# Altium schematic sheet BUCKCONVERTER - POWER.SchDoc
size A4; SheetNumber: 4; SheetTotal: 5
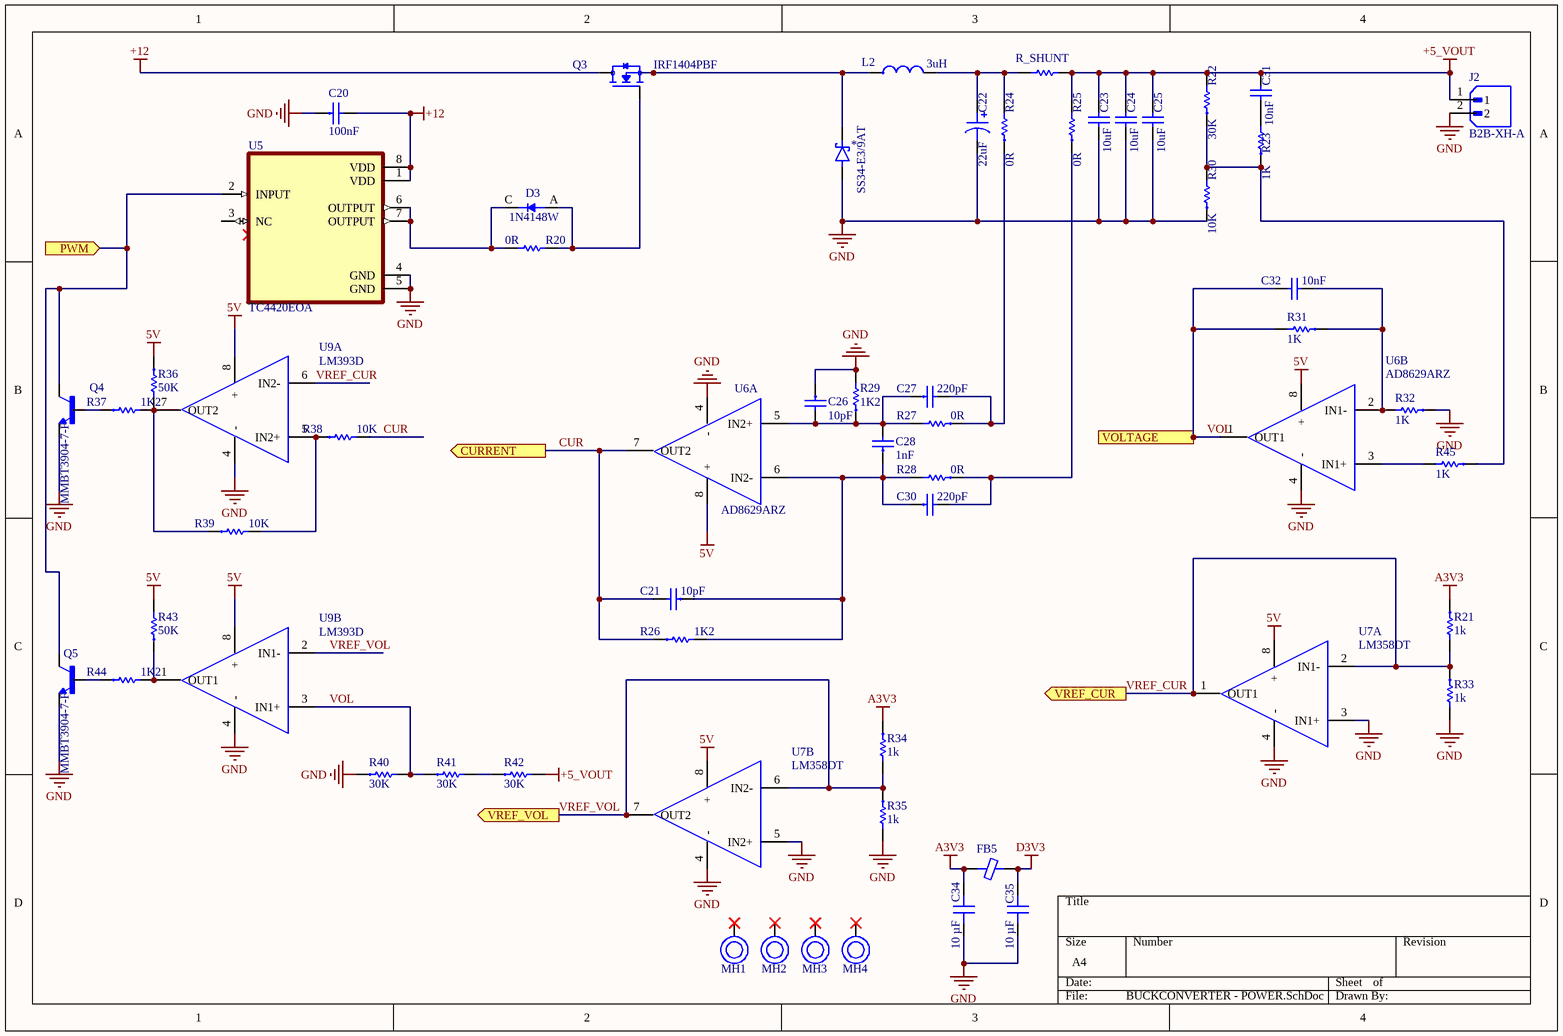
[diagram p0: BUCKCONVERTER - POWER.SchDoc]

## Parts
*  SS34-E3/9AT  [SS34]
C20  100nF  [CAP-CER0402-20mil]
C21  10pF  [CAP-CER0603-0.8H]
C22  22uF  [330UF-5mm]
C23  10uF  [Cap cer 0603]
C24  10uF  [Cap cer 0603]
C25  10uF  [Cap cer 0603]
C26  10pF  [CAP-CER0603-0.8H]
C27  220pF  [CAP-CER0603-0.8H]
C28  1nF  [CAP-CER0603-0.8H]
C30  220pF  [CAP-CER0603-0.8H]
C31  10nF  [Cap cer 0603]
C32  10nF  [Cap cer 0603]
C34  10 µF  [CAP 0603]
C35  10 µF  [CAP 0603]
D3  1N4148W  [1N4148]
FB5  330 Ohms @ 100 MHz  [FB_0603]  (value not drawn)
J2  B2B-XH-A  [JST_B2B-XH-A]
L2  3uH  [IND-06030-1uH]
MH1  MOUNTING HOLE  [M3]  (value not drawn)
MH2  MOUNTING HOLE  [M3]  (value not drawn)
MH3  MOUNTING HOLE  [M3]  (value not drawn)
MH4  MOUNTING HOLE  [M3]  (value not drawn)
Q3  IRF1404PBF  [TO220 AB]
Q4  MMBT3904-7-F  [MMBT3904]
Q5  MMBT3904-7-F  [MMBT3904]
R20  0R  [Res 0603]
R21  1k  [RES-CHP0402-0.35H]
R22  30K  [RES-CHP0603-0.45H-272]
R23  1K  [RES-CHP0603-0.45H-272]
R24  0R  [RES-CHP0603-0.45H-272]
R25  0R  [RES-CHP0603-0.45H-272]
R26  1K2  [RES-CHP0603-0.45H-272]
R27  0R  [RES-CHP0603-0.45H-272]
R28  0R  [RES-CHP0603-0.45H-272]
R29  1K2  [RES-CHP0603-0.45H-272]
R30  10K  [RES-CHP0603-0.45H-272]
R31  1K  [RES-CHP0603-0.45H-272]
R32  1K  [RES-CHP0603-0.45H-272]
R33  1k  [RES-CHP0402-0.35H]
R34  1k  [RES-CHP0402-0.35H]
R35  1k  [RES-CHP0402-0.35H]
R36  50K  [RES-CHP0603-0.45H-272]
R37  1K2  [RES-CHP0603-0.45H-272]
R38  10K  [RES-CHP0603-0.45H-272]
R39  10K  [RES-CHP0603-0.45H-272]
R40  30K  [RES-CHP0402-0.35H]
R41  30K  [RES-CHP0402-0.35H]
R42  30K  [RES-CHP0402-0.35H]
R43  50K  [RES-CHP0603-0.45H-272]
R44  1K2  [RES-CHP0603-0.45H-272]
R45  1K  [RES-CHP0603-0.45H-272]
R_SHUNT  0.01R  [R_SHUNT]  (value not drawn)
U5  TC4420EOA  [SOIC127P600X175-8N]
U6  AD8629ARZ  [AD8629ARZ]  (parts A,B of 2)
U7  LM358DT  [SOIC 8]  (parts A,B of 2)
U9  LM393D  [LM393]  (parts A,B of 2)

## Ports
CURRENT (out), PWM (in), VOLTAGE (out), VREF_CUR (out), VREF_VOL (out)

## Nets
5V: R36.1 R43.2 U6.8(+) U7.8(+) U9.8(+)
+5_VOUT: C23.2 C24.2 C25.2 C31.2 J2.1 R22.2 R25.2 R42.2 R_SHUNT.2
+12: C20.2 Q3.2(D) U5.1(VDD) U5.8(VDD)
A3V3: C34.2 FB5.1 R21.1 R34.1
D3V3: C35.2 FB5.2
GND: *.A C20.1 C22.2 C23.1 C24.1 C25.1 C26.1 C34.1 C35.1 J2.2 Q4.E Q5.E R29.2 R30.1 R32.1 R33.2 R35.2 R40.1 U5.4(GND) U5.5(GND) U6.4(-) U7.3(IN1+) U7.4(-) U7.5(IN2+) U9.4(-)
CUR: C21.2 R26.1 R38.2 U6.7(OUT2) ; port CURRENT
PWM: Q4.C Q5.C U5.2(INPUT) ; port PWM
VOL: C32.2 R31.2 R40.2 R41.1 U6.1(OUT1) U9.3(IN1+) ; port VOLTAGE
VREF_CUR: R21.2 R33.1 U7.1(OUT1) U7.2(IN1-) U9.6(IN2-) ; port VREF_CUR
VREF_VOL: R34.2 R35.1 U7.6(IN2-) U7.7(OUT2) U9.2(IN1-) ; port VREF_VOL
Net*_C: *.C(K) L2.1 Q3.3(S)
NetC21_1: C21.1 C28.1 C30.1 R26.2 R28.2 U6.6(IN2-)
NetC22_1: C22.1 L2.2 R24.2 R_SHUNT.1
NetC26_2: C26.2 C27.1 C28.2 R27.2 R29.1 U6.5(IN2+)
NetC27_2: C27.2 R24.1 R27.1
NetC30_2: C30.2 R25.1 R28.1
NetC31_1: C31.1 R23.2
NetC32_1: C32.1 R31.1 R32.2 U6.2(IN1-)
NetD3_A: D3.A Q3.1(G) R20.2
NetD3_C: D3.C(K) R20.1 U5.6(OUTPUT) U5.7(OUTPUT)
NetQ4_B: Q4.B R37.1
NetQ5_B: Q5.B R44.1
NetR22_1: R22.1 R23.1 R30.2 R45.1
NetR36_2: R36.2 R37.2 R39.1 U9.7(OUT2)
NetR38_1: R38.1 R39.2 U9.5(IN2+)
NetR41_2: R41.2 R42.1
NetR43_1: R43.1 R44.2 U9.1(OUT1)
NetR45_2: R45.2 U6.3(IN1+)

Not connected (* = marked no-connect by the designer): MH1 1(GND)*; MH2 1(GND)*; MH3 1(GND)*; MH4 1(GND)*; U5 3(NC)

## Library data of the parts
* = SS34-E3/9AT: Rectifier Diode, Schottky, 1 Phase, 1 Element, 3A, 40V V(RRM), Silicon, DO-214AB; Manufacturer: Vishay; Element Configuration: Single; Forward Voltage: 500mV; Max Forward Surge Current (Ifsm): 100A; Max Junction Temperature (Tj): 150°C; Max Reverse Leakage Current: 500µA; Number of Elements: 1; Supplier 1: Avnet; Manufacturer Part Number: SS34-E3/9AT; RoHS: Compliant; Category: Rectifier Diodes; Stock 1: 31500; Pricing 1: 3500=0,08437 (USD); Average Rectified Current: 3A; Case/Package: SMC; China RoHS: Non-Compliant; Forward Current: 3A; Height: 2.62mm; Lifecycle Status: Production; Max Operating Temperature: 150°C; Max Output Current: 3A; Max Repetitive Reverse Voltage (Vrrm): 40V; Max Reverse Voltage (DC): 40V; Max Surge Current: 100A; Min Operating Temperature: -55°C; Mount: Surface Mount; Number of Pins: 2; Number of Terminals: 2; Peak Non-Repetitive Surge Current: 100A; Peak Reverse Current: 500µA; Radiation Hardening: No; REACH SVHC: No; Reverse Standoff Voltage: 40V; Reverse Voltage: 40V; Schedule B: 8541100080, 8541100080|8541100080|8541100080|8541100080|8541100080; ComponentLink1URL: https://datasheet.octopart.com:443/SS34-E3-9AT-Vishay-datasheet-181475108.pdf?src-supplier=IHS; ComponentLink1Description: https://datasheet.octopart.com:443/SS34-E3-9AT-Vishay-datasheet-181475108.pdf?src-supplier=IHS; ComponentLink2URL: https://datasheet.octopart.com:443/SS34-E3-9AT-Vishay-datasheet-138899081.pdf?src-supplier=Upverter; ComponentLink2Description: https://datasheet.octopart.com:443/SS34-E3-9AT-Vishay-datasheet-138899081.pdf?src-supplier=Upverter; ComponentLink3URL: https://datasheet.octopart.com:443/SS34-E3-9AT-Vishay-datasheet-188933186.pdf?src-supplier=TME; ComponentLink3Description: https://datasheet.octopart.com:443/SS34-E3-9AT-Vishay-datasheet-188933186.pdf?src-supplier=TME; ComponentLink4URL: https://datasheet.octopart.com:443/SS34-E3-9AT-Vishay-datasheet-15599040.pdf?src-supplier=Future+Electronics; ComponentLink4Description: https://datasheet.octopart.com:443/SS34-E3-9AT-Vishay-datasheet-15599040.pdf?src-supplier=Future+Electronics; ComponentLink5URL: https://datasheet.octopart.com:443/SS34-E3/9AT-Vishay-datasheet-11610764.pdf?src-supplier=Arrow+Electronics; ComponentLink5Description: https://datasheet.octopart.com:443/SS34-E3/9AT-Vishay-datasheet-11610764.pdf?src-supplier=Arrow+Electronics; ComponentLink6URL: http://sigma.octopart.com:80/rohs_statement/Vishay-company-15.pdf?src-supplier=Compliance+Statements; ComponentLink6Description: http://sigma.octopart.com:80/rohs_statement/Vishay-company-15.pdf?src-supplier=Compliance+Statements; Supplier Part Number 1: SS34-E3/9AT
C20 = CAPCER0040 10uF 20% 6.3V X5R 0402 SMD: CAP CER 10uF 20% 6.3V X5R 0402 SMD; LINE: SMT; TYPE: EP; UNIT: PCS; TMG PN: CAPCER0013; TMG CODE: None; CERTIFICATION: NA; CLASS: B; MOUNT: SMD; ComponentLink1Description: Datasheet; ComponentLink1URL: https://datasheet.lcsc.com/lcsc/2304140030_YAGEO-CC0402MRX5R5BB106_C105884.pdf; Footprint: 0402
C21 C26-C28 C30 = CAPCER0003 220pF 10% 50V X7R 0603 SMD: CAP CER 220pF 10% 50V X7R 0603 SMD; LINE: SMT; TYPE: EP; UNIT: PCS; TMG CODE: None; CERTIFICATION: NA; CLASS: B; MOUNT: SMD; TMG PN: CAPCER0003; ComponentLink1Description: Datasheet; ComponentLink1URL: https://datasheet.lcsc.com/lcsc/1810261515_Samsung-Electro-Mechanics-CL10B221KB8NNNC_C1603.pdf; Footprint: 0603
C22 = CAP 47uF 63V_1
C23-C25 = GRT188R61E106ME13D: SMD Multilayer Ceramic Capacitor, 10 ï¿½F, 25 V, 0603 [1608 Metric], ï¿½ 20%, X5R; Manufacturer: Murata; Material: 4241ConductorMaterial; Voltage Rating: 25V; Supplier 1: Digikey; Manufacturer Part Number: GRT188R61E106ME13D; RoHS: No; Category: Ceramic Capacitors; Stock 1: 354696; Pricing 1: 1=0.25, 10=0.151, 100=0.0931, 4000=0.06965, 8000=0.0635, 12000=0.05993, 20000=0.05654, 28000=0.04257 (USD); Mount: Surface Mount; Case/Package: 0603; Case Code (Metric): 1608; Case Code (Imperial): 0603; Weight: 0.000917oz; Min Operating Temperature: -55°C; Max Operating Temperature: 85°C; Packaging: Cut Tape; Capacitance: 10uF; Tolerance: 20%; Series: GRT; Termination: Standard; Voltage Rating (DC): 25V; Dielectric: X5R; Package Quantity: 4000; Length: 1.6mm; Width: 0.8mm; Height: 0.8mm; Ratings: AEC-Q200; RoHS Compliant: No; ComponentLink1URL: https://datasheet.octopart.com/GRT188R61E106ME13D-Murata-datasheet-149523595.pdf?src-supplier=Newark; ComponentLink1Description: https://datasheet.octopart.com/GRT188R61E106ME13D-Murata-datasheet-149523595.pdf?src-supplier=Newark; ComponentLink2URL: https://datasheet.octopart.com/GRT188R61E106ME13D-Murata-datasheet-82944876.pdf?src-supplier=Future+Electronics; ComponentLink2Description: https://datasheet.octopart.com/GRT188R61E106ME13D-Murata-datasheet-82944876.pdf?src-supplier=Future+Electronics; ComponentLink3URL: http://search.murata.co.jp/Ceramy/image/img/A01X/G101/ENG/GRT188R61E106ME13-01.pdf?src-supplier=Digikey; ComponentLink3Description: http://search.murata.co.jp/Ceramy/image/img/A01X/G101/ENG/GRT188R61E106ME13-01.pdf?src-supplier=Digikey; ComponentLink4URL: https://search.murata.co.jp/Ceramy/image/img/A01X/G101/ENG/GRT188R61E106ME13-01.pdf?src-supplier=Digikey; ComponentLink4Description: https://search.murata.co.jp/Ceramy/image/img/A01X/G101/ENG/GRT188R61E106ME13-01.pdf?src-supplier=Digikey; ComponentLink5URL: https://datasheet.octopart.com/GRT188R61E106ME13D-Murata-datasheet-165579666.pdf?src-supplier=TME; ComponentLink5Description: https://datasheet.octopart.com/GRT188R61E106ME13D-Murata-datasheet-165579666.pdf?src-supplier=TME; Supplier Part Number 1: 490-12323-1-ND
C31 C32 = GRT188R61E106ME13D: SMD Multilayer Ceramic Capacitor, 10 ï¿½F, 25 V, 0603 [1608 Metric], ï¿½ 20%, X5R; Manufacturer: Murata; Material: 4241ConductorMaterial; Capacitance: 10uF; Voltage Rating: 25V; Supplier 1: Digikey; Manufacturer Part Number: GRT188R61E106ME13D; RoHS: No; Category: Ceramic Capacitors; Stock 1: 354696; Pricing 1: 1=0.25, 10=0.151, 100=0.0931, 4000=0.06965, 8000=0.0635, 12000=0.05993, 20000=0.05654, 28000=0.04257 (USD); Mount: Surface Mount; Case/Package: 0603; Case Code (Metric): 1608; Case Code (Imperial): 0603; Weight: 0.000917oz; Min Operating Temperature: -55°C; Max Operating Temperature: 85°C; Packaging: Cut Tape; Tolerance: 20%; Series: GRT; Termination: Standard; Voltage Rating (DC): 25V; Dielectric: X5R; Package Quantity: 4000; Length: 1.6mm; Width: 0.8mm; Height: 0.8mm; Ratings: AEC-Q200; RoHS Compliant: No; ComponentLink1URL: https://datasheet.octopart.com/GRT188R61E106ME13D-Murata-datasheet-149523595.pdf?src-supplier=Newark; ComponentLink1Description: https://datasheet.octopart.com/GRT188R61E106ME13D-Murata-datasheet-149523595.pdf?src-supplier=Newark; ComponentLink2URL: https://datasheet.octopart.com/GRT188R61E106ME13D-Murata-datasheet-82944876.pdf?src-supplier=Future+Electronics; ComponentLink2Description: https://datasheet.octopart.com/GRT188R61E106ME13D-Murata-datasheet-82944876.pdf?src-supplier=Future+Electronics; ComponentLink3URL: http://search.murata.co.jp/Ceramy/image/img/A01X/G101/ENG/GRT188R61E106ME13-01.pdf?src-supplier=Digikey; ComponentLink3Description: http://search.murata.co.jp/Ceramy/image/img/A01X/G101/ENG/GRT188R61E106ME13-01.pdf?src-supplier=Digikey; ComponentLink4URL: https://search.murata.co.jp/Ceramy/image/img/A01X/G101/ENG/GRT188R61E106ME13-01.pdf?src-supplier=Digikey; ComponentLink4Description: https://search.murata.co.jp/Ceramy/image/img/A01X/G101/ENG/GRT188R61E106ME13-01.pdf?src-supplier=Digikey; ComponentLink5URL: https://datasheet.octopart.com/GRT188R61E106ME13D-Murata-datasheet-165579666.pdf?src-supplier=TME; ComponentLink5Description: https://datasheet.octopart.com/GRT188R61E106ME13D-Murata-datasheet-165579666.pdf?src-supplier=TME; Supplier Part Number 1: 490-12323-1-ND
C34 C35 = GMC10X7R106K10NT: CAP0603 X7R 10UF 10% 10V; manufacturer: Cal-Chip Electronics, Inc.; Part Number: GMC10X7R106K10NT; Value: 10 µF; Applications: General Purpose; Capacitance: 10 µF; componentlink1description: Datasheet; componentlink1url: https://88ce57.p3cdn1.secureserver.net/wp-content/uploads/2023/01/gmc_series-2.pdf; componentlink2description: DigiKey Link; componentlink2url: https://www.digikey.com/en/products/detail/cal-chip-electronics-inc/GMC10X7R106K10NT/18151126; Device Package: 0603 (1608 Metric); lastupdated: 2/9/2024 8:09:39 PM; Lifecycle Status: Active; Minimum Order: 1; Mounting Type: Surface Mount, MLCC; Operating Temperature: -55°C ~ 125°C; Package / Case: 0603 (1608 Metric); packaging: TapeAndReel; partid: 49835; Part Status: Active; price: 0.26; series: GMC; Size / Dimension: 0.063" L x 0.031" W (1.60mm x 0.80mm); Supplier 1: DigiKey; Supplier Part Number 1: 4713-GMC10X7R106K10NTCT-ND; Temperature Coefficient: X7R; Thickness (Max): 0.039" (1.00mm); Tolerance: ±10%; Voltage - Rated: 10V
D3 = 1N4148W-7-F: Small Signal Diode, Single, 100 V, 300 Ma, 1.25 V, 4 Ns, 2 A Rohs Compliant: Yes; Manufacturer: Diodes; Forward Current: 150mA; Reverse Recovery Time: 4ns; Max Repetitive Reverse Voltage (Vrrm): 100V; Max Forward Surge Current (Ifsm): 2A; Max Reverse Current: 1uA; Forward Voltage: 1.25V; Average Rectified Current: 300mA; Power Dissipation: 400mW; Polarity: Standard; Capacitance: 2pF; Voltage Rating (DC): 75V; Supplier 1: Arrow Electronics; Manufacturer Part Number: 1N4148W-7-F; RoHS: Yes; Category: Rectifier Diodes; Stock 1: 4485000; Pricing 1: 9000=0.0099, 15000=0.0099, 21000=0.0099, 30000=0.0099, 75000=0.0099 (USD); Mount: Surface Mount; Number of Pins: 2; Weight: 0.000353oz; Min Operating Temperature: -65°C; Max Operating Temperature: 150°C; Packaging: Tape and Reel; Peak Non-Repetitive Surge Current: 2A; Max Surge Current: 2A; Package Quantity: 3000; Recovery Time: 4ns; Power Rating: 400mW; Current Rating: 150mA; Output Current: 150mA; Voltage: 100V; Max Reverse Voltage (DC): 100V; Series: -; Reverse Recovery Time-Max: 4ns; Reverse Voltage: 100V; Length: 2.85mm; Width: 1.7mm; Height: 1.25mm; Radiation Hardening: No; Reach SVHC Compliant: No; Lead Free: Lead Free; RoHS Compliant: Yes; ComponentLink1URL: https://datasheet.ciiva.com/8303/ds30086-8303197.pdf?src-supplier=Avnet; ComponentLink1Description: https://datasheet.ciiva.com/8303/ds30086-8303197.pdf?src-supplier=Avnet; ComponentLink2URL: https://datasheet.ciiva.com/911/ds30086-911735.pdf?src-supplier=Digikey; ComponentLink2Description: https://datasheet.ciiva.com/911/ds30086-911735.pdf?src-supplier=Digikey; ComponentLink3URL: https://datasheet.ciiva.com/911/ds30086-911736.pdf?src-supplier=Digikey; ComponentLink3Description: https://datasheet.ciiva.com/911/ds30086-911736.pdf?src-supplier=Digikey; ComponentLink4URL: https://datasheet.ciiva.com/911/ds30086-911734.pdf?src-supplier=Digikey; ComponentLink4Description: https://datasheet.ciiva.com/911/ds30086-911734.pdf?src-supplier=Digikey; ComponentLink5URL: https://datasheet.ciiva.com/1179/1915529-1179304.pdf?src-supplier=Element14; ComponentLink5Description: https://datasheet.ciiva.com/1179/1915529-1179304.pdf?src-supplier=Element14; ComponentLink6URL: https://datasheet.ciiva.com/22695/1915529-22695239.pdf?src-supplier=Element14; ComponentLink6Description: https://datasheet.ciiva.com/22695/1915529-22695239.pdf?src-supplier=Element14; ComponentLink7URL: https://datasheet.ciiva.com/8300/ds30086-8300392.pdf?src-supplier=Avnet; ComponentLink7Description: https://datasheet.ciiva.com/8300/ds30086-8300392.pdf?src-supplier=Avnet; ComponentLink8URL: https://datasheet.ciiva.com/15219/getdatasheetpartid-110030-15219548.pdf?src-supplier=Verical; ComponentLink8Description: https://datasheet.ciiva.com/15219/getdatasheetpartid-110030-15219548.pdf?src-supplier=Verical; ComponentLink9URL: https://datasheet.ciiva.com/4435/ds30086-4435128.pdf?src-supplier=Mouser; ComponentLink9Description: https://datasheet.ciiva.com/4435/ds30086-4435128.pdf?src-supplier=Mouser; Supplier Part Number 1: 1N4148W-7-F
FB5 = BLM18KG331SH1D: FERRITE BEAD 330 OHM 0603 1LN; Manufacturer: Murata Electronics; Current Rating (Max): 1.7A; DC Resistance (DCR) (Max): 80mOhm; Filter Type: Power Line; Number of Lines: 1; Part Number: BLM18KG331SH1D; ComponentLink1Description: Datasheet; ComponentLink1URL: https://www.murata.com/en-global/products/productdata/8796737273886/QNFA9101.pdf; ComponentLink2Description: DigiKey Link; ComponentLink2URL: https://www.digikey.com/en/products/detail/murata-electronics/BLM18KG331SH1D/5881246; Device Package: 0603 (1608 Metric); Height (Max): 0.037" (0.95mm); Impedance @ Frequency: 330 Ohms @ 100 MHz; LastUpdated: 3/11/2024 7:43:28 AM; Lifecycle Status: Active; Minimum Order: 1; Mounting Type: Surface Mount; Operating Temperature: -55°C ~ 125°C; Package / Case: 0603 (1608 Metric); Packaging: TapeAndReel; PartId: 932; Part Status: Active; Price: 0.02; Ratings: AEC-Q200; Series: EMIFIL®, BLM18; Size / Dimension: 0.063" L x 0.032" W (1.60mm x 0.80mm); Supplier 1: DigiKey; Supplier Part Number 1: 490-13257-1-ND; Value: 330 Ohms @ 100 MHz
J2 = B2B-XH-A: MF: {'manufacturer': u'JST Sales America Inc.'}; Package: None; Price: None; Value: *; MP: B2B-XH-A; Availability: Unavailable
L2 = INDMOI0013 1W2T 1.5uH 20% 14A 0630 SMD: IND MOI 1W2T 1.5uH 20% 14A 0630 SMD; LINE: SMT; TYPE: EP; UNIT: PCS; TMG CODE: None; CERTIFICATION: NA; CLASS: B; MOUNT: SMD; ComponentLink1Description: Datasheet; ComponentLink1URL: https://datasheet.lcsc.com/lcsc/2210101130_SHOU-HAN-CYA0630-1-5UH_C5189745.pdf
MH1-MH4 = MH
Q3 = IRF1404PBF: Single N-Channel 40 V 0.004 Ohm 196 nC HEXFET® Power Mosfet - TO-220-3; Manufacturer: Infineon; Continuous Drain Current (ID): 75A; Current Rating: 162A; Drain to Source Breakdown Voltage: 40V; Drain to Source Resistance: 4mΩ; Fall Time: 33ns; Gate to Source Voltage (Vgs): 20V; Input Capacitance: 5.669nF; Max Junction Temperature (Tj): 175°C; Max Power Dissipation: 200W; Nominal Vgs: 4V; Number of Channels: 1; Recovery Time: 117ns; Rise Time: 190ns; Turn-Off Delay Time: 46ns; Turn-On Delay Time: 17ns; Supplier 1: Arrow Electronics; Manufacturer Part Number: IRF1404PBF; RoHS: Compliant; Category: MOSFETs; Stock 1: 284019; Pricing 1: 1=0,5792 (USD); Case/Package: TO-220AB; China RoHS: Non-Compliant; Contact Plating: Tin; Drain to Source Voltage (Vdss): 40V; Dual Supply Voltage: 40V; Element Configuration: Single; Height: 19.8mm; Lead Free: Lead Free; Lead Pitch: 2.54mm; Length: 10.668mm; Lifecycle Status: Production; Max Operating Temperature: 175°C; Min Breakdown Voltage: 40V; Min Operating Temperature: -55°C; Mount: Through Hole; Number of Elements: 1; Number of Pins: 3; Number of Terminals: 3; On-State Resistance: 4mΩ; Package Quantity: 1000; Packaging: Bulk; Power Dissipation: 200W; Radiation Hardening: No; Rds On Max: 4mΩ; REACH SVHC: Yes; Resistance: 4mΩ; Schedule B: 8541290080, 8541290080|8541290080, 8541290080|8541290080|8541290080, 8541290080|8541290080|8541290080|8541290080; Termination: Through Hole; Threshold Voltage: 4V; Voltage Rating (DC): 40V; Width: 4.826mm; ComponentLink1URL: https://datasheet.octopart.com:443/IRF1404PBF-Infineon-datasheet-180066866.pdf?src-supplier=IHS; ComponentLink1Description: https://datasheet.octopart.com:443/IRF1404PBF-Infineon-datasheet-180066866.pdf?src-supplier=IHS; ComponentLink2URL: https://datasheet.octopart.com:443/IRF1404PBF-Infineon-datasheet-62314054.pdf?src-supplier=IHS; ComponentLink2Description: https://datasheet.octopart.com:443/IRF1404PBF-Infineon-datasheet-62314054.pdf?src-supplier=IHS; ComponentLink3URL: https://datasheet.octopart.com:443/IRF1404PBF-Infineon-datasheet-8117651.pdf?src-supplier=IHS; ComponentLink3Description: https://datasheet.octopart.com:443/IRF1404PBF-Infineon-datasheet-8117651.pdf?src-supplier=IHS; ComponentLink4URL: https://datasheet.octopart.com:443/IRF1404PBF-Infineon-datasheet-10898762.pdf?src-supplier=Factory+Futures; ComponentLink4Description: https://datasheet.octopart.com:443/IRF1404PBF-Infineon-datasheet-10898762.pdf?src-supplier=Factory+Futures; ComponentLink5URL: https://datasheet.octopart.com:443/IRF1404PBF-Infineon-datasheet-8329159.pdf?src-supplier=Factory+Futures; ComponentLink5Description: https://datasheet.octopart.com:443/IRF1404PBF-Infineon-datasheet-8329159.pdf?src-supplier=Factory+Futures; ComponentLink6URL: https://datasheet.octopart.com:443/IRF1404PBF-International-Rectifier-datasheet-7273.pdf?src-supplier=Newark; ComponentLink6Description: https://datasheet.octopart.com:443/IRF1404PBF-International-Rectifier-datasheet-7273.pdf?src-supplier=Newark; ComponentLink7URL: https://datasheet.octopart.com:443/IRF1404PBF-International-Rectifier-datasheet-14061466.pdf?src-supplier=iiiC; ComponentLink7Description: https://datasheet.octopart.com:443/IRF1404PBF-International-Rectifier-datasheet-14061466.pdf?src-supplier=iiiC; ComponentLink8URL: https://datasheet.octopart.com:443/IRF1404-International-Rectifier-datasheet-10847710.pdf?src-supplier=iiiC; ComponentLink8Description: https://datasheet.octopart.com:443/IRF1404-International-Rectifier-datasheet-10847710.pdf?src-supplier=iiiC; ComponentLink9URL: https://datasheet.octopart.com:443/IRF1404PBF-Infineon-datasheet-10021476.pdf?src-supplier=RS+(Formerly+Allied+Electronics); ComponentLink9Description: https://datasheet.octopart.com:443/IRF1404PBF-Infineon-datasheet-10021476.pdf?src-supplier=RS+(Formerly+Allied+Electronics); ComponentLink10URL: https://datasheet.octopart.com:443/IRF1404PBF-International-Rectifier-datasheet-7628077.pdf?src-supplier=Jameco; ComponentLink10Description: https://datasheet.octopart.com:443/IRF1404PBF-International-Rectifier-datasheet-7628077.pdf?src-supplier=Jameco; ComponentLink11URL: https://datasheet.octopart.com:443/IRF1404PBF-International-Rectifier-datasheet-8134560.pdf?src-supplier=Farnell; ComponentLink11Description: https://datasheet.octopart.com:443/IRF1404PBF-International-Rectifier-datasheet-8134560.pdf?src-supplier=Farnell; ComponentLink12URL: https://datasheet.octopart.com:443/IRF1404PBF-International-Rectifier-datasheet-90335.pdf?src-supplier=DigiKey; ComponentLink12Description: https://datasheet.octopart.com:443/IRF1404PBF-International-Rectifier-datasheet-90335.pdf?src-supplier=DigiKey; ComponentLink13URL: http://sigma.octopart.com:80/conflict_mineral_statement/Infineon-company-51.pdf?src-supplier=Compliance+Statements; ComponentLink13Description: http://sigma.octopart.com:80/conflict_mineral_statement/Infineon-company-51.pdf?src-supplier=Compliance+Statements; ComponentLink14URL: http://sigma.octopart.com:80/rohs_statement/International-Rectifier-company-54.pdf?src-supplier=Compliance+Statements; ComponentLink14Description: http://sigma.octopart.com:80/rohs_statement/International-Rectifier-company-54.pdf?src-supplier=Compliance+Statements; ComponentLink15URL: http://sigma.octopart.com:80/reach_statement/International-Rectifier-company-55.pdf?src-supplier=Compliance+Statements; ComponentLink15Description: http://sigma.octopart.com:80/reach_statement/International-Rectifier-company-55.pdf?src-supplier=Compliance+Statements; Supplier Part Number 1: IRF1404PBF
Q4 Q5 = MMBT3904-7-F: Transistor General Purpose BJT NPN 40 Volt 0.2A Automotive 3-Pin SOT-23; Manufacturer: Diodes Zetex; Max Power Dissipation: 300mW; hFE Min: 100; Max Collector Current: 200mA; Transition Frequency: 300MHz; Collector Emitter Breakdown Voltage: 40V; Collector Base Voltage (VCBO): 60V; Emitter Base Voltage (VEBO): 6V; Collector-emitter Voltage-Max: 300mV; Number of Elements: 1; Power Dissipation: 350mW; Supplier 1: Arrow Electronics; Manufacturer Part Number: MMBT3904-7-F; RoHS: Yes; Category: BJTs; Stock 1: 969000; Pricing 1: 3000=0.0199, 6000=0.017, 9000=0.0168, 15000=0.0149, 21000=0.0147, 30000=0.0128, 75000=0.0127, 150000=0.0126, 300000=0.0105 (USD); Mount: Surface Mount; Case/Package: SOT-23; Number of Pins: 3; Weight: 0.000282oz; Min Operating Temperature: -55°C; Max Operating Temperature: 150°C; Polarity: NPN; Packaging: Tape and Reel; Package Quantity: 3000; Max Breakdown Voltage: 40V; Continuous Collector Current: 200mA; Gain Bandwidth Product: 300MHz; Voltage Rating (DC): 40V; Series: Automotive, AEC-Q101; Frequency: 300MHz; Collector Emitter Voltage (VCEO): 40V; Collector Emitter Saturation Voltage: 300mV; Max Frequency: 300MHz; Length: 3.05mm; Width: 1.4mm; Height: 1mm; Radiation Hardening: No; Reach SVHC Compliant: No; Lead Free: Lead Free; RoHS Compliant: Yes; ComponentLink1URL: https://datasheet.ciiva.com/11201/ds30036-11201778.pdf?src-supplier=Avnet; ComponentLink1Description: https://datasheet.ciiva.com/11201/ds30036-11201778.pdf?src-supplier=Avnet; ComponentLink2URL: https://datasheet.ciiva.com/15138/getdatasheetpartid-53265-15138780.pdf?src-supplier=Verical; ComponentLink2Description: https://datasheet.ciiva.com/15138/getdatasheetpartid-53265-15138780.pdf?src-supplier=Verical; ComponentLink3URL: https://datasheet.ciiva.com/22711/1915516-22711750.pdf?src-supplier=Element14; ComponentLink3Description: https://datasheet.ciiva.com/22711/1915516-22711750.pdf?src-supplier=Element14; ComponentLink4URL: https://datasheet.ciiva.com/11198/ds30036-11198999.pdf?src-supplier=Avnet; ComponentLink4Description: https://datasheet.ciiva.com/11198/ds30036-11198999.pdf?src-supplier=Avnet; ComponentLink5URL: https://datasheet.ciiva.com/6361/ds30036-6361256.pdf?src-supplier=Digikey; ComponentLink5Description: https://datasheet.ciiva.com/6361/ds30036-6361256.pdf?src-supplier=Digikey; ComponentLink6URL: https://datasheet.ciiva.com/6361/ds30036-6361254.pdf?src-supplier=Digikey; ComponentLink6Description: https://datasheet.ciiva.com/6361/ds30036-6361254.pdf?src-supplier=Digikey; Supplier Part Number 1: MMBT3904-7-F
R20 = Resistor 0R: Res Thick Film 0603 0 Ohm Pad SMD T/R; Manufacturer: Vishay; Manufacturer Part Number: CRCW06030000Z0EBC; Max Power Dissipation: 100mW; Voltage Rating: 75V; Supplier 1: Arrow Electronics; RoHS: Yes; Category: Chip SMD Resistors; Stock 1: 4; Pricing 1: 1=0.005 (USD); Case/Package: 0603; Case Code (Imperial): 0603; Case Code (Metric): 1608; Min Operating Temperature: -55°C; Max Operating Temperature: 155°C; Packaging: Cut Tape; Resistance: 0R; Number of Terminations: 2; Series: CRCW-C; Power Rating: 100mW; Height: 550um; RoHS Compliant: Yes; Lead Free: 5697LeadFree; ComponentLink1URL: http://www.vishay.com/docs/28773/crcwce3.pdf?src-supplier=Digikey; ComponentLink1Description: http://www.vishay.com/docs/28773/crcwce3.pdf?src-supplier=Digikey; Supplier Part Number 1: CRCW06030000Z0EBC
R21 R33-R35 R40-R42 = RESCHP0085 33K 1% 0402 SMD: RES CHP 33K 1% 1/16W 0402 SMD; LINE: SMT; UNIT: PCS; TMG CODE: None; CERTIFICATION: NA; CLASS: B; MOUNT: SMD; TYPE: EP; ComponentLink1Description: Datasheet; ComponentLink1URL: https://datasheet.lcsc.com/lcsc/2304140030_YAGEO-AC0402FR-0775KL_C144737.pdf
R22-R32 R36-R39 R43-R45 = RESCHP0195 2K7 1% 0603 SMD: RES CHP 2K7 1% 1/10W 0603 SMD; LINE: SMT; UNIT: PCS; TMG CODE: None; CERTIFICATION: NA; CLASS: B; MOUNT: SMD; TYPE: EP; TMG PN: RESCHP0195; ComponentLink1Description: Datasheet; ComponentLink1URL: https://datasheet.lcsc.com/lcsc/2304140030_YAGEO-RC0603FR-072K7L_C114612.pdf; Footprint: 0603
R_SHUNT = R_SHUNT
U5 = TC4420EOA: Microchip TC4420EOA,MOSFET Power Driver 6A,4.5 to 18V,Non-Inverting,8-Pin SOIC | Microchip Technology Inc. TC4420EOA; SnapEDA_Link: https://www.snapeda.com/parts/TC4420EOA/Microchip/view-part/?ref=snap; Package: SOIC-8 Microchip; Value: *; MF: Microchip; MP: TC4420EOA; Check_prices: https://www.snapeda.com/parts/TC4420EOA/Microchip/view-part/?ref=eda
U6 = AD8629ARZ: IC OPAMP ZERO-DRIFT 2 CIRC 8SOIC Zero-Drift Amplifier 2 Circuit Rail-to-Rail 8-SOIC; Manufacturer: Analog Devices; Manufacturer Lifecycle Status: PRODUCTION; -3db Bandwidth: 2.5MHz; Common Mode Rejection Ratio: 140dB; Gain: 120dB; Input Bias Current: 30pA; Input Capacitance: 10pF; Input Offset Voltage (Vos): 5µV; Max Dual Supply Voltage: 2.5V; Max Supply Current: 2.2mA; Max Supply Voltage: 5V; Min Dual Supply Voltage: 1.35V; Min Supply Voltage: 2.7V; Number of Amplifiers: 2; Operating Supply Voltage: 3V; Output Current per Channel: 30mA; Power Supply Rejection Ratio (PSRR): 130dB; Quiescent Current: 1.1mA; Slew Rate: 1V/µs; Voltage Gain: 145dB; Supplier 1: Arrow Electronics; Manufacturer Part Number: AD8629ARZ; RoHS: Compliant; Category: Amplifiers - Op Amps, Buffer, Instrumentation; Stock 1: 3408; Pricing 1: 1=6,808, 10=4,527, 25=3,207, 98=2,961, 294=2,8, 588=2,655 (USD); Bandwidth: 2.5MHz; Case/Package: R; Contact Plating: Tin; Gain Bandwidth Product: 2.5MHz; Height: 1.5mm; Length: 5mm; Lifecycle Status: Production; Max Operating Temperature: 125°C; Min Operating Temperature: -40°C; Number of Channels: 2; Number of Circuits: 2; Number of Elements: 2; Number of Pins: 8; Operating Supply Current: 2.2mA; Radiation Hardening: No; REACH SVHC: No; Schedule B: 8542330000; Width: 4mm; ComponentLink1URL: https://datasheet.octopart.com:443/AD8629ARZ-Analog-Devices-datasheet-42968418.pdf?src-supplier=Analog+Devices; ComponentLink1Description: https://datasheet.octopart.com:443/AD8629ARZ-Analog-Devices-datasheet-42968418.pdf?src-supplier=Analog+Devices; ComponentLink2URL: https://octopart.com:443/opatz8j6/c1?t=aWeMBPM-JELAnCcbC-n1WTTrasgumx2A8BiJtAhLoS8u_17NOkMzPt3gzRWoakvQXXH3NC3R8gFX4G48g061UaBXGwogGE1Uj-8sqvtrqgK1sY7jDh3eWAwH1CQwPW1Jv6IADWKJqAiwnXxASv0RMDRSm7LbjcggLYfRMDkPTzyCQChyI1msocHWpd5h7OrGjev3Iz3E-o2_l5cB9yrdImHcqb4LtoQO-WcXBt-1DHy8NwqhYNIhrkYjFsx4VNs9gn0Mq788wCztvxO1GP0L9zgs0I_y0NnBDPP4_fEzu3H-nfdZ63w&src-supplier=Analog+Devices; ComponentLink2Description: https://octopart.com:443/opatz8j6/c1?t=aWeMBPM-JELAnCcbC-n1WTTrasgumx2A8BiJtAhLoS8u_17NOkMzPt3gzRWoakvQXXH3NC3R8gFX4G48g061UaBXGwogGE1Uj-8sqvtrqgK1sY7jDh3eWAwH1CQwPW1Jv6IADWKJqAiwnXxASv0RMDRSm7LbjcggLYfRMDkPTzyCQChyI1msocHWpd5h7OrGjev3Iz3E-o2_l5cB9yrdImHcqb4LtoQO-WcXBt-1DHy8NwqhYNIhrkYjFsx4VNs9gn0Mq788wCztvxO1GP0L9zgs0I_y0NnBDPP4_fEzu3H-nfdZ63w&src-supplier=Analog+Devices; ComponentLink3URL: https://datasheet.octopart.com:443/AD8629ARZ-Analog-Devices-datasheet-10103768.pdf?src-supplier=Upverter; ComponentLink3Description: https://datasheet.octopart.com:443/AD8629ARZ-Analog-Devices-datasheet-10103768.pdf?src-supplier=Upverter; ComponentLink4URL: https://datasheet.octopart.com:443/AD8629ARZ-Analog-Devices-datasheet-5322301.pdf?src-supplier=Upverter; ComponentLink4Description: https://datasheet.octopart.com:443/AD8629ARZ-Analog-Devices-datasheet-5322301.pdf?src-supplier=Upverter; ComponentLink5URL: https://datasheet.octopart.com:443/AD8629ARZ-Analog-Devices-datasheet-23752859.pdf?src-supplier=Upverter; ComponentLink5Description: https://datasheet.octopart.com:443/AD8629ARZ-Analog-Devices-datasheet-23752859.pdf?src-supplier=Upverter; ComponentLink6URL: https://datasheet.octopart.com:443/AD8629ARZ-Analog-Devices-datasheet-8858042.pdf?src-supplier=Upverter; ComponentLink6Description: https://datasheet.octopart.com:443/AD8629ARZ-Analog-Devices-datasheet-8858042.pdf?src-supplier=Upverter; ComponentLink7URL: https://datasheet.octopart.com:443/AD8629ARZ-Analog-Devices-datasheet-32048149.pdf?src-supplier=element14+APAC; ComponentLink7Description: https://datasheet.octopart.com:443/AD8629ARZ-Analog-Devices-datasheet-32048149.pdf?src-supplier=element14+APAC; ComponentLink8URL: https://datasheet.octopart.com:443/AD8629ARZ-Analog-Devices-datasheet-101563144.pdf?src-supplier=element14+APAC; ComponentLink8Description: https://datasheet.octopart.com:443/AD8629ARZ-Analog-Devices-datasheet-101563144.pdf?src-supplier=element14+APAC; ComponentLink9URL: https://datasheet.octopart.com:443/AD8629ARZ-Analog-Devices-datasheet-9458.pdf?src-supplier=TME; ComponentLink9Description: https://datasheet.octopart.com:443/AD8629ARZ-Analog-Devices-datasheet-9458.pdf?src-supplier=TME; ComponentLink10URL: https://datasheet.octopart.com:443/AD8629ARZ-Analog-Devices-datasheet-14139723.pdf?src-supplier=iiiC; ComponentLink10Description: https://datasheet.octopart.com:443/AD8629ARZ-Analog-Devices-datasheet-14139723.pdf?src-supplier=iiiC; ComponentLink11URL: https://datasheet.octopart.com:443/AD8629ARZ-Analog-Devices-datasheet-9815337.pdf?src-supplier=RS+(Formerly+Allied+Electronics); ComponentLink11Description: https://datasheet.octopart.com:443/AD8629ARZ-Analog-Devices-datasheet-9815337.pdf?src-supplier=RS+(Formerly+Allied+Electronics); ComponentLink12URL: http://sigma.octopart.com:80/conflict_mineral_statement/Analog-Devices-company-33.pdf?src-supplier=Compliance+Statements; ComponentLink12Description: http://sigma.octopart.com:80/conflict_mineral_statement/Analog-Devices-company-33.pdf?src-supplier=Compliance+Statements; ComponentLink13URL: https://octopart.com:443/opatz8j6/c1?t=GuIiLQSqHR5UtH-ccvOgZ_rMPgdoDO9MBhNGz1lrC6uFtX1Ty2dLJJE3esEi3LdxH2WSZGSDEcND3r14vXW1YQGdY8YbjY8rd4j2rV3vc971hwplIN7mnrJEC29glHuaUEUKb6evx9vL8H9Okke6qfKuVvzeC_JtJbwHi1gEpzxsUdW9RNtRF7Nil8ktKupsHU6F-uGzSovI8YJeOX7T-MxaDqzLTa9fFFbbKuS3iXo0ronF4OJTx1UqYg6AqVsvYcdlTWC_iXVQ4-Dde1iCmj54rakYuCUCE_xobSzT3w-tBTMj6Ew&src-supplier=Compliance+Statements; ComponentLink13Description: https://octopart.com:443/opatz8j6/c1?t=GuIiLQSqHR5UtH-ccvOgZ_rMPgdoDO9MBhNGz1lrC6uFtX1Ty2dLJJE3esEi3LdxH2WSZGSDEcND3r14vXW1YQGdY8YbjY8rd4j2rV3vc971hwplIN7mnrJEC29glHuaUEUKb6evx9vL8H9Okke6qfKuVvzeC_JtJbwHi1gEpzxsUdW9RNtRF7Nil8ktKupsHU6F-uGzSovI8YJeOX7T-MxaDqzLTa9fFFbbKuS3iXo0ronF4OJTx1UqYg6AqVsvYcdlTWC_iXVQ4-Dde1iCmj54rakYuCUCE_xobSzT3w-tBTMj6Ew&src-supplier=Compliance+Statements; Supplier Part Number 1: AD8629ARZ
U7 = LM358DT: Operational Amplifier, 2-Channels, 1.1 MHz, 0.6 V/us, 3 V to 30 V, 8 Pins, SOIC; Manufacturer: STMicroelectronics; Supplier 1: Arrow Electronics; Manufacturer Part Number: LM358DT; RoHS: Yes; Category: Amplifiers - Op Amps, Buffer, Instrumentation; Stock 1: 6035000; Pricing 1: 2500=0,0596, 10000=0,056, 20000=0,0553 (USD); Lead Free: 5697LeadFree; ComponentLink1URL: https://datasheet.ciiva.com/15129/getdatasheetpartid-39583-15129679.pdf?src-supplier=Verical; ComponentLink1Description: https://datasheet.ciiva.com/15129/getdatasheetpartid-39583-15129679.pdf?src-supplier=Verical; ComponentLink2URL: https://datasheet.ciiva.com/29306/155599-da-01-en-op-verst-lm358dt-stm-29306826.pdf?src-supplier=Conrad; ComponentLink2Description: https://datasheet.ciiva.com/29306/155599-da-01-en-op-verst-lm358dt-stm-29306826.pdf?src-supplier=Conrad; ComponentLink3URL: https://datasheet.ciiva.com/14544/70013561-14544747.pdf?src-supplier=Allied+Electronics; ComponentLink3Description: https://datasheet.ciiva.com/14544/70013561-14544747.pdf?src-supplier=Allied+Electronics; ComponentLink4URL: https://datasheet.ciiva.com/16371/cd00000464-16371207.pdf?src-supplier=Future+Electronics; ComponentLink4Description: https://datasheet.ciiva.com/16371/cd00000464-16371207.pdf?src-supplier=Future+Electronics; ComponentLink5URL: https://datasheet.ciiva.com/1795/cd00000464-1795490.pdf?src-supplier=Digikey; ComponentLink5Description: https://datasheet.ciiva.com/1795/cd00000464-1795490.pdf?src-supplier=Digikey; ComponentLink6URL: https://datasheet.ciiva.com/1795/cd00000464-1795491.pdf?src-supplier=Digikey; ComponentLink6Description: https://datasheet.ciiva.com/1795/cd00000464-1795491.pdf?src-supplier=Digikey; ComponentLink7URL: https://datasheet.ciiva.com/1795/cd00000464-1795492.pdf?src-supplier=Digikey; ComponentLink7Description: https://datasheet.ciiva.com/1795/cd00000464-1795492.pdf?src-supplier=Digikey; Supplier Part Number 1: LM358DT
U9 = LM393D: LM393 Series Dual 36 V 250 nA SMT Low Power Voltage Comparator - SOIC-8; Manufacturer: STMicroelectronics; Dual Supply Voltage: 9V; Input Bias Current: 250nA; Input Offset Voltage (Vos): 9mV; Max Dual Supply Voltage: 18V; Max Junction Temperature (Tj): 150°C; Max Power Dissipation: 710mW; Max Supply Current: 2.5mA; Max Supply Voltage: 36V; Min Dual Supply Voltage: 1V; Min Supply Voltage: 2V; Natural Thermal Resistance: 125°C/W; Nominal Supply Current: 1mA; Number of Channels: 2; Operating Supply Voltage: 5V; Output Current per Channel: 18mA; Output Type: TTL; Propagation Delay: 1.3µs; Voltage Gain: 106.02dB; Supplier 1: Arrow Electronics; Manufacturer Part Number: LM393D; RoHS: Compliant; Category: Comparators; Stock 1: 279976; Pricing 1: 1=0,3302, 10=0,325, 25=0,324, 100=0,322, 250=0,32, 2000=0,319, 4000=0,238 (USD); Ambient Temperature Range High: 70°C; Case/Package: SO; China RoHS: Compliant; Height: 1.75mm; Height - Seated (Max): 1.75mm; Lead Free: Lead Free; Length: 4.9mm; Lifecycle Status: Production; Max Input Current: 250nA; Max Operating Temperature: 70°C; Min Operating Temperature: 0°C; Mount: Surface Mount; Number of Circuits: 2; Number of Elements: 2; Number of Pins: 8; Number of Terminals: 8; Power Dissipation: 710mW; Quiescent Current: 2.5mA; Radiation Hardening: No; REACH SVHC: Yes; Response Time: 1.3µs; Schedule B: 8542390000, 8542390000|8542390000, 8542390000|8542390000|8542390000, 8542390000|8542390000|8542390000|8542390000; Terminal Pitch: 1.27mm; Turn-On Delay Time: 1.3µs; Type: General Purpose; Weight: 4.535924g; Width: 3.9mm; ComponentLink1URL: https://datasheet.octopart.com:443/LM393D-STMicroelectronics-datasheet-62333484.pdf?src-supplier=SHENGYU+ELECTRONICS; ComponentLink1Description: https://datasheet.octopart.com:443/LM393D-STMicroelectronics-datasheet-62333484.pdf?src-supplier=SHENGYU+ELECTRONICS; ComponentLink2URL: https://datasheet.octopart.com:443/LM393D-STMicroelectronics-datasheet-11803910.pdf?src-supplier=element14+APAC; ComponentLink2Description: https://datasheet.octopart.com:443/LM393D-STMicroelectronics-datasheet-11803910.pdf?src-supplier=element14+APAC; ComponentLink3URL: https://datasheet.octopart.com:443/LM393D-STMicroelectronics-datasheet-10410545.pdf?src-supplier=Future+Electronics; ComponentLink3Description: https://datasheet.octopart.com:443/LM393D-STMicroelectronics-datasheet-10410545.pdf?src-supplier=Future+Electronics; ComponentLink4URL: https://datasheet.octopart.com:443/LM393D-STMicroelectronics-datasheet-21220619.pdf?src-supplier=Future+Electronics; ComponentLink4Description: https://datasheet.octopart.com:443/LM393D-STMicroelectronics-datasheet-21220619.pdf?src-supplier=Future+Electronics; ComponentLink5URL: https://datasheet.octopart.com:443/LM393D-STMicroelectronics-datasheet-14897319.pdf?src-supplier=TME; ComponentLink5Description: https://datasheet.octopart.com:443/LM393D-STMicroelectronics-datasheet-14897319.pdf?src-supplier=TME; ComponentLink6URL: https://datasheet.octopart.com:443/LM393D-STMicroelectronics-datasheet-163154.pdf?src-supplier=element14; ComponentLink6Description: https://datasheet.octopart.com:443/LM393D-STMicroelectronics-datasheet-163154.pdf?src-supplier=element14; ComponentLink7URL: https://datasheet.octopart.com:443/LM393D-STMicroelectronics-datasheet-616567.pdf?src-supplier=element14; ComponentLink7Description: https://datasheet.octopart.com:443/LM393D-STMicroelectronics-datasheet-616567.pdf?src-supplier=element14; ComponentLink8URL: https://datasheet.octopart.com:443/LM393D-STMicroelectronics-datasheet-8451836.pdf?src-supplier=Farnell; ComponentLink8Description: https://datasheet.octopart.com:443/LM393D-STMicroelectronics-datasheet-8451836.pdf?src-supplier=Farnell; ComponentLink9URL: https://datasheet.octopart.com:443/LM393D-STMicroelectronics-datasheet-7654.pdf?src-supplier=Nu+Horizons; ComponentLink9Description: https://datasheet.octopart.com:443/LM393D-STMicroelectronics-datasheet-7654.pdf?src-supplier=Nu+Horizons; ComponentLink10URL: https://datasheet.octopart.com:443/LM393D-STMicroelectronics-datasheet-14143375.pdf?src-supplier=iiiC; ComponentLink10Description: https://datasheet.octopart.com:443/LM393D-STMicroelectronics-datasheet-14143375.pdf?src-supplier=iiiC; ComponentLink11URL: https://datasheet.octopart.com:443/LM393D-STMicroelectronics-datasheet-9797164.pdf?src-supplier=RS+(Formerly+Allied+Electronics); ComponentLink11Description: https://datasheet.octopart.com:443/LM393D-STMicroelectronics-datasheet-9797164.pdf?src-supplier=RS+(Formerly+Allied+Electronics); ComponentLink12URL: https://datasheet.octopart.com:443/LM393D-STMicroelectronics-datasheet-52703.pdf?src-supplier=RS+(Formerly+Allied+Electronics); ComponentLink12Description: https://datasheet.octopart.com:443/LM393D-STMicroelectronics-datasheet-52703.pdf?src-supplier=RS+(Formerly+Allied+Electronics); Supplier Part Number 1: LM393D